# Altium schematic sheet SRAM.SchDoc
size A4
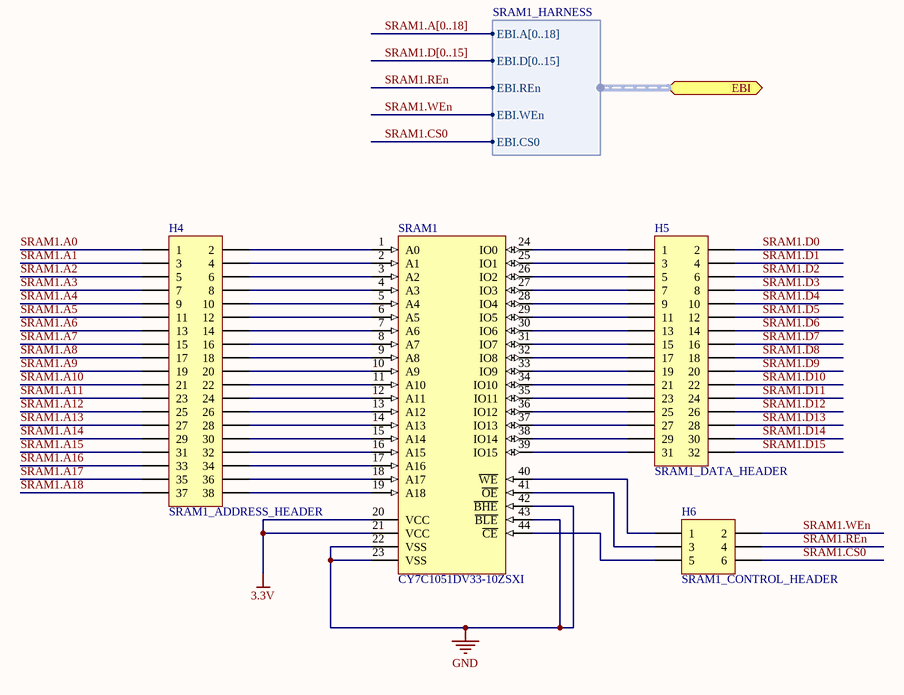
[diagram p0: SRAM.SchDoc]

## Parts
H4  SRAM1_ADDRESS_HEADER  [HDR2X19]
H5  SRAM1_DATA_HEADER  [HDR2X16]
H6  SRAM1_CONTROL_HEADER  [HDR2X3]
SRAM1  CY7C1051DV33-10ZSXI  [TSOP-44-SRAM]

## Ports
EBI (harness SRAM1_HARNESS)

## Harnesses
SRAM1_HARNESS: EBI.A[0..18], EBI.D[0..15], EBI.REn, EBI.WEn, EBI.CS0

## Nets
3.3V: SRAM1.20(VCC) SRAM1.21(VCC)
GND: SRAM1.22(VSS) SRAM1.23(VSS) SRAM1.42(~{BHE}) SRAM1.43(~{BLE})
SRAM1.A0: H4.1
SRAM1.A1: H4.3
SRAM1.A2: H4.5
SRAM1.A3: H4.7
SRAM1.A4: H4.9
SRAM1.A5: H4.11
SRAM1.A6: H4.13
SRAM1.A7: H4.15
SRAM1.A8: H4.17
SRAM1.A9: H4.19
SRAM1.A10: H4.21
SRAM1.A11: H4.23
SRAM1.A12: H4.25
SRAM1.A13: H4.27
SRAM1.A14: H4.29
SRAM1.A15: H4.31
SRAM1.A16: H4.33
SRAM1.A17: H4.35
SRAM1.A18: H4.37
SRAM1.CS0: H6.6 ; port EBI.EBI.CS0
SRAM1.D0: H5.2
SRAM1.D1: H5.4
SRAM1.D2: H5.6
SRAM1.D3: H5.8
SRAM1.D4: H5.10
SRAM1.D5: H5.12
SRAM1.D6: H5.14
SRAM1.D7: H5.16
SRAM1.D8: H5.18
SRAM1.D9: H5.20
SRAM1.D10: H5.22
SRAM1.D11: H5.24
SRAM1.D12: H5.26
SRAM1.D13: H5.28
SRAM1.D14: H5.30
SRAM1.D15: H5.32
SRAM1.REn: H6.4 ; port EBI.EBI.REn
SRAM1.WEn: H6.2 ; port EBI.EBI.WEn
NetH4_2: H4.2 SRAM1.1(A0)
NetH4_4: H4.4 SRAM1.2(A1)
NetH4_6: H4.6 SRAM1.3(A2)
NetH4_8: H4.8 SRAM1.4(A3)
NetH4_10: H4.10 SRAM1.5(A4)
NetH4_12: H4.12 SRAM1.6(A5)
NetH4_14: H4.14 SRAM1.7(A6)
NetH4_16: H4.16 SRAM1.8(A7)
NetH4_18: H4.18 SRAM1.9(A8)
NetH4_20: H4.20 SRAM1.10(A9)
NetH4_22: H4.22 SRAM1.11(A10)
NetH4_24: H4.24 SRAM1.12(A11)
NetH4_26: H4.26 SRAM1.13(A12)
NetH4_28: H4.28 SRAM1.14(A13)
NetH4_30: H4.30 SRAM1.15(A14)
NetH4_32: H4.32 SRAM1.16(A15)
NetH4_34: H4.34 SRAM1.17(A16)
NetH4_36: H4.36 SRAM1.18(A17)
NetH4_38: H4.38 SRAM1.19(A18)
NetH5_1: H5.1 SRAM1.24(IO0)
NetH5_3: H5.3 SRAM1.25(IO1)
NetH5_5: H5.5 SRAM1.26(IO2)
NetH5_7: H5.7 SRAM1.27(IO3)
NetH5_9: H5.9 SRAM1.28(IO4)
NetH5_11: H5.11 SRAM1.29(IO5)
NetH5_13: H5.13 SRAM1.30(IO6)
NetH5_15: H5.15 SRAM1.31(IO7)
NetH5_17: H5.17 SRAM1.32(IO8)
NetH5_19: H5.19 SRAM1.33(IO9)
NetH5_21: H5.21 SRAM1.34(IO10)
NetH5_23: H5.23 SRAM1.35(IO11)
NetH5_25: H5.25 SRAM1.36(IO12)
NetH5_27: H5.27 SRAM1.37(IO13)
NetH5_29: H5.29 SRAM1.38(IO14)
NetH5_31: H5.31 SRAM1.39(IO15)
NetH6_1: H6.1 SRAM1.40(~{WE})
NetH6_3: H6.3 SRAM1.41(~{OE})
NetH6_5: H6.5 SRAM1.44(~{CE})

## Buses and harness runs
bus SRAM1.A[0..18]
bus SRAM1.D[0..15]

## Library data of the parts
H4 = Header 19X2: Header, 19-Pin, Dual row; LatestRevisionDate: 17-Jul-2002; LatestRevisionNote: Re-released for DXP Platform.; Publisher: Altium Limited
H5 = Header 16X2: Header, 16-Pin, Dual row; LatestRevisionDate: 17-Jul-2002; LatestRevisionNote: Re-released for DXP Platform.; Publisher: Altium Limited
H6 = Header 3X2: Header, 3-Pin, Dual row; LatestRevisionDate: 17-Jul-2002; LatestRevisionNote: Re-released for DXP Platform.; Publisher: Altium Limited
SRAM1 = CY7C1051DV33-10ZSXI: pin to pad: 6>18 7>19 8>20 9>21 10>22 11>23 12>24 13>25 14>26 15>27 16>42 17>43 18>44 19>28 20>11 21>33 22>12 23>34 24>7 25>8 26>9 27>10 28>13 29>14 30>15 31>16 32>29 33>30 34>31 35>32 36>35 37>36 38>37 39>38 40>17 42>40 43>39 44>6